# Altium schematic sheet Filtro.SchDoc
size A4
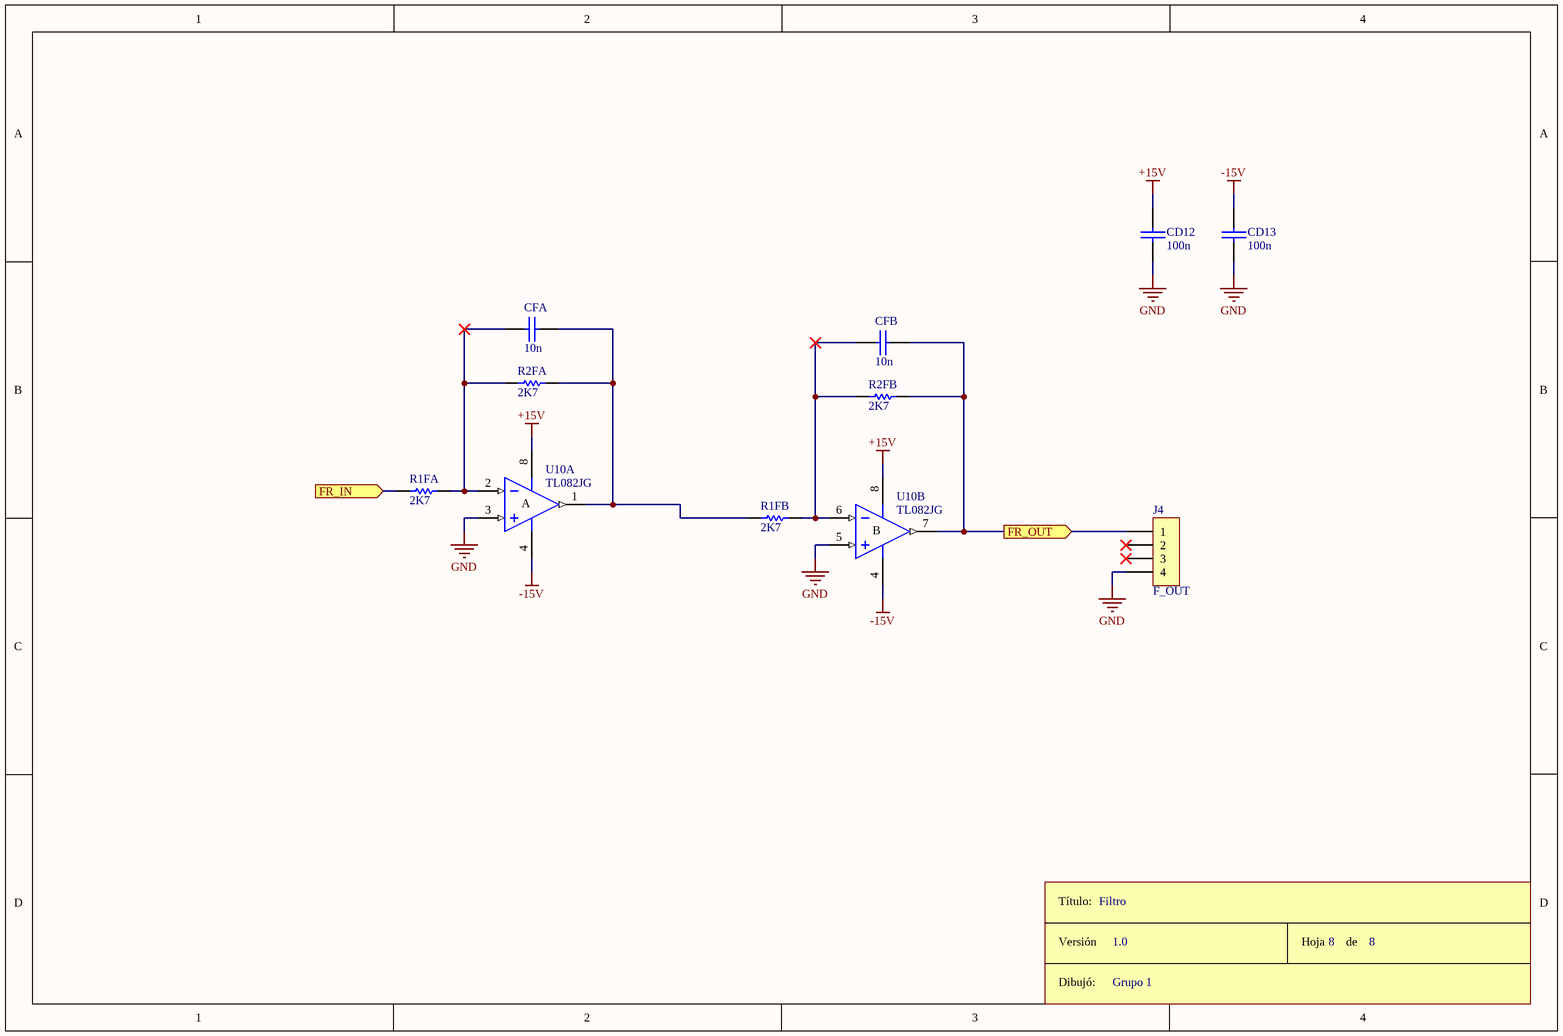
[diagram p0: Filtro.SchDoc]

## Parts
CD12  100n  [CAP100]
CD13  100n  [CAP100]
CFA  10n  [CAP100]
CFB  10n  [CAP100]
J4  F_OUT  [SIP4]
R1FA  2K7  [RES300]
R1FB  2K7  [RES400]
R2FA  2K7  [RES300]
R2FB  2K7  [RES300]
ROT8  Rótulo  (value not drawn)
U10  TL082JG  [JG008]  (parts A,B of 2)

## Ports
FR_IN (in), FR_OUT (out)

## Nets
+15V: CD12.1 U10.8(V+)
-15V: CD13.1 U10.4(V-)
GND: CD12.2 CD13.2 J4.4 U10.3(IN+) U10.5(IN+)
FR_IN: R1FA.1 ; port FR_IN
FR_OUT: CFB.2 J4.1 R2FB.2 U10.7(OUT) ; port FR_OUT
NetCFA_1: CFA.1 R1FA.2 R2FA.1 U10.2(IN-)
NetCFA_2: CFA.2 R1FB.1 R2FA.2 U10.1(OUT)
NetCFB_1: CFB.1 R1FB.2 R2FB.1 U10.6(IN-)

Not connected (* = marked no-connect by the designer): J4 2* 3*

## Notes on the sheet
- Filtro
- 1.0
- Grupo 1
- 8
- (in symbol Rótulo) Título:; Versión; Hoja       de; Dibujó:
- (in symbol TL082JG, part A) A
- (in symbol TL082JG, part B) B

## Library data of the parts
CD12 CD13 CFA CFB = CAP
J4 = CON4
R1FA R1FB R2FA R2FB = RES
U10 = TL082JG: JFET-Input Operational Amplifier; Published: 16-Jan-2001; LatestRevisionDate: 04-Mar-2005; LatestRevisionNote: Stylized 3D Model Added.; DatasheetVersion: Feb-1999; PackageVersion: Jan-1995; PackageReference: JG008; Publisher: Altium Limited; PackageDescription: DIP; 8 Leads; Row Spacing 7.62 mm; Pitch 2.54 mm; ComponentLink1Description: Manufacturer Link; ComponentLink1URL: http://www.ti.com/; ComponentLink2Description: Datasheet; ComponentLink2URL: http://www-s.ti.com/sc/ds/tl082.pdf